# EasyEDA schematic bleeding_edge_full_control_pcb_layout.json
TITLE: BE Rancilio-PID - FULL CONTROL -  PCB Layout; REV: 0.7; Date: 2023-02-23; Sheet: 1/1; Company: bleeding edge rancilio-pid
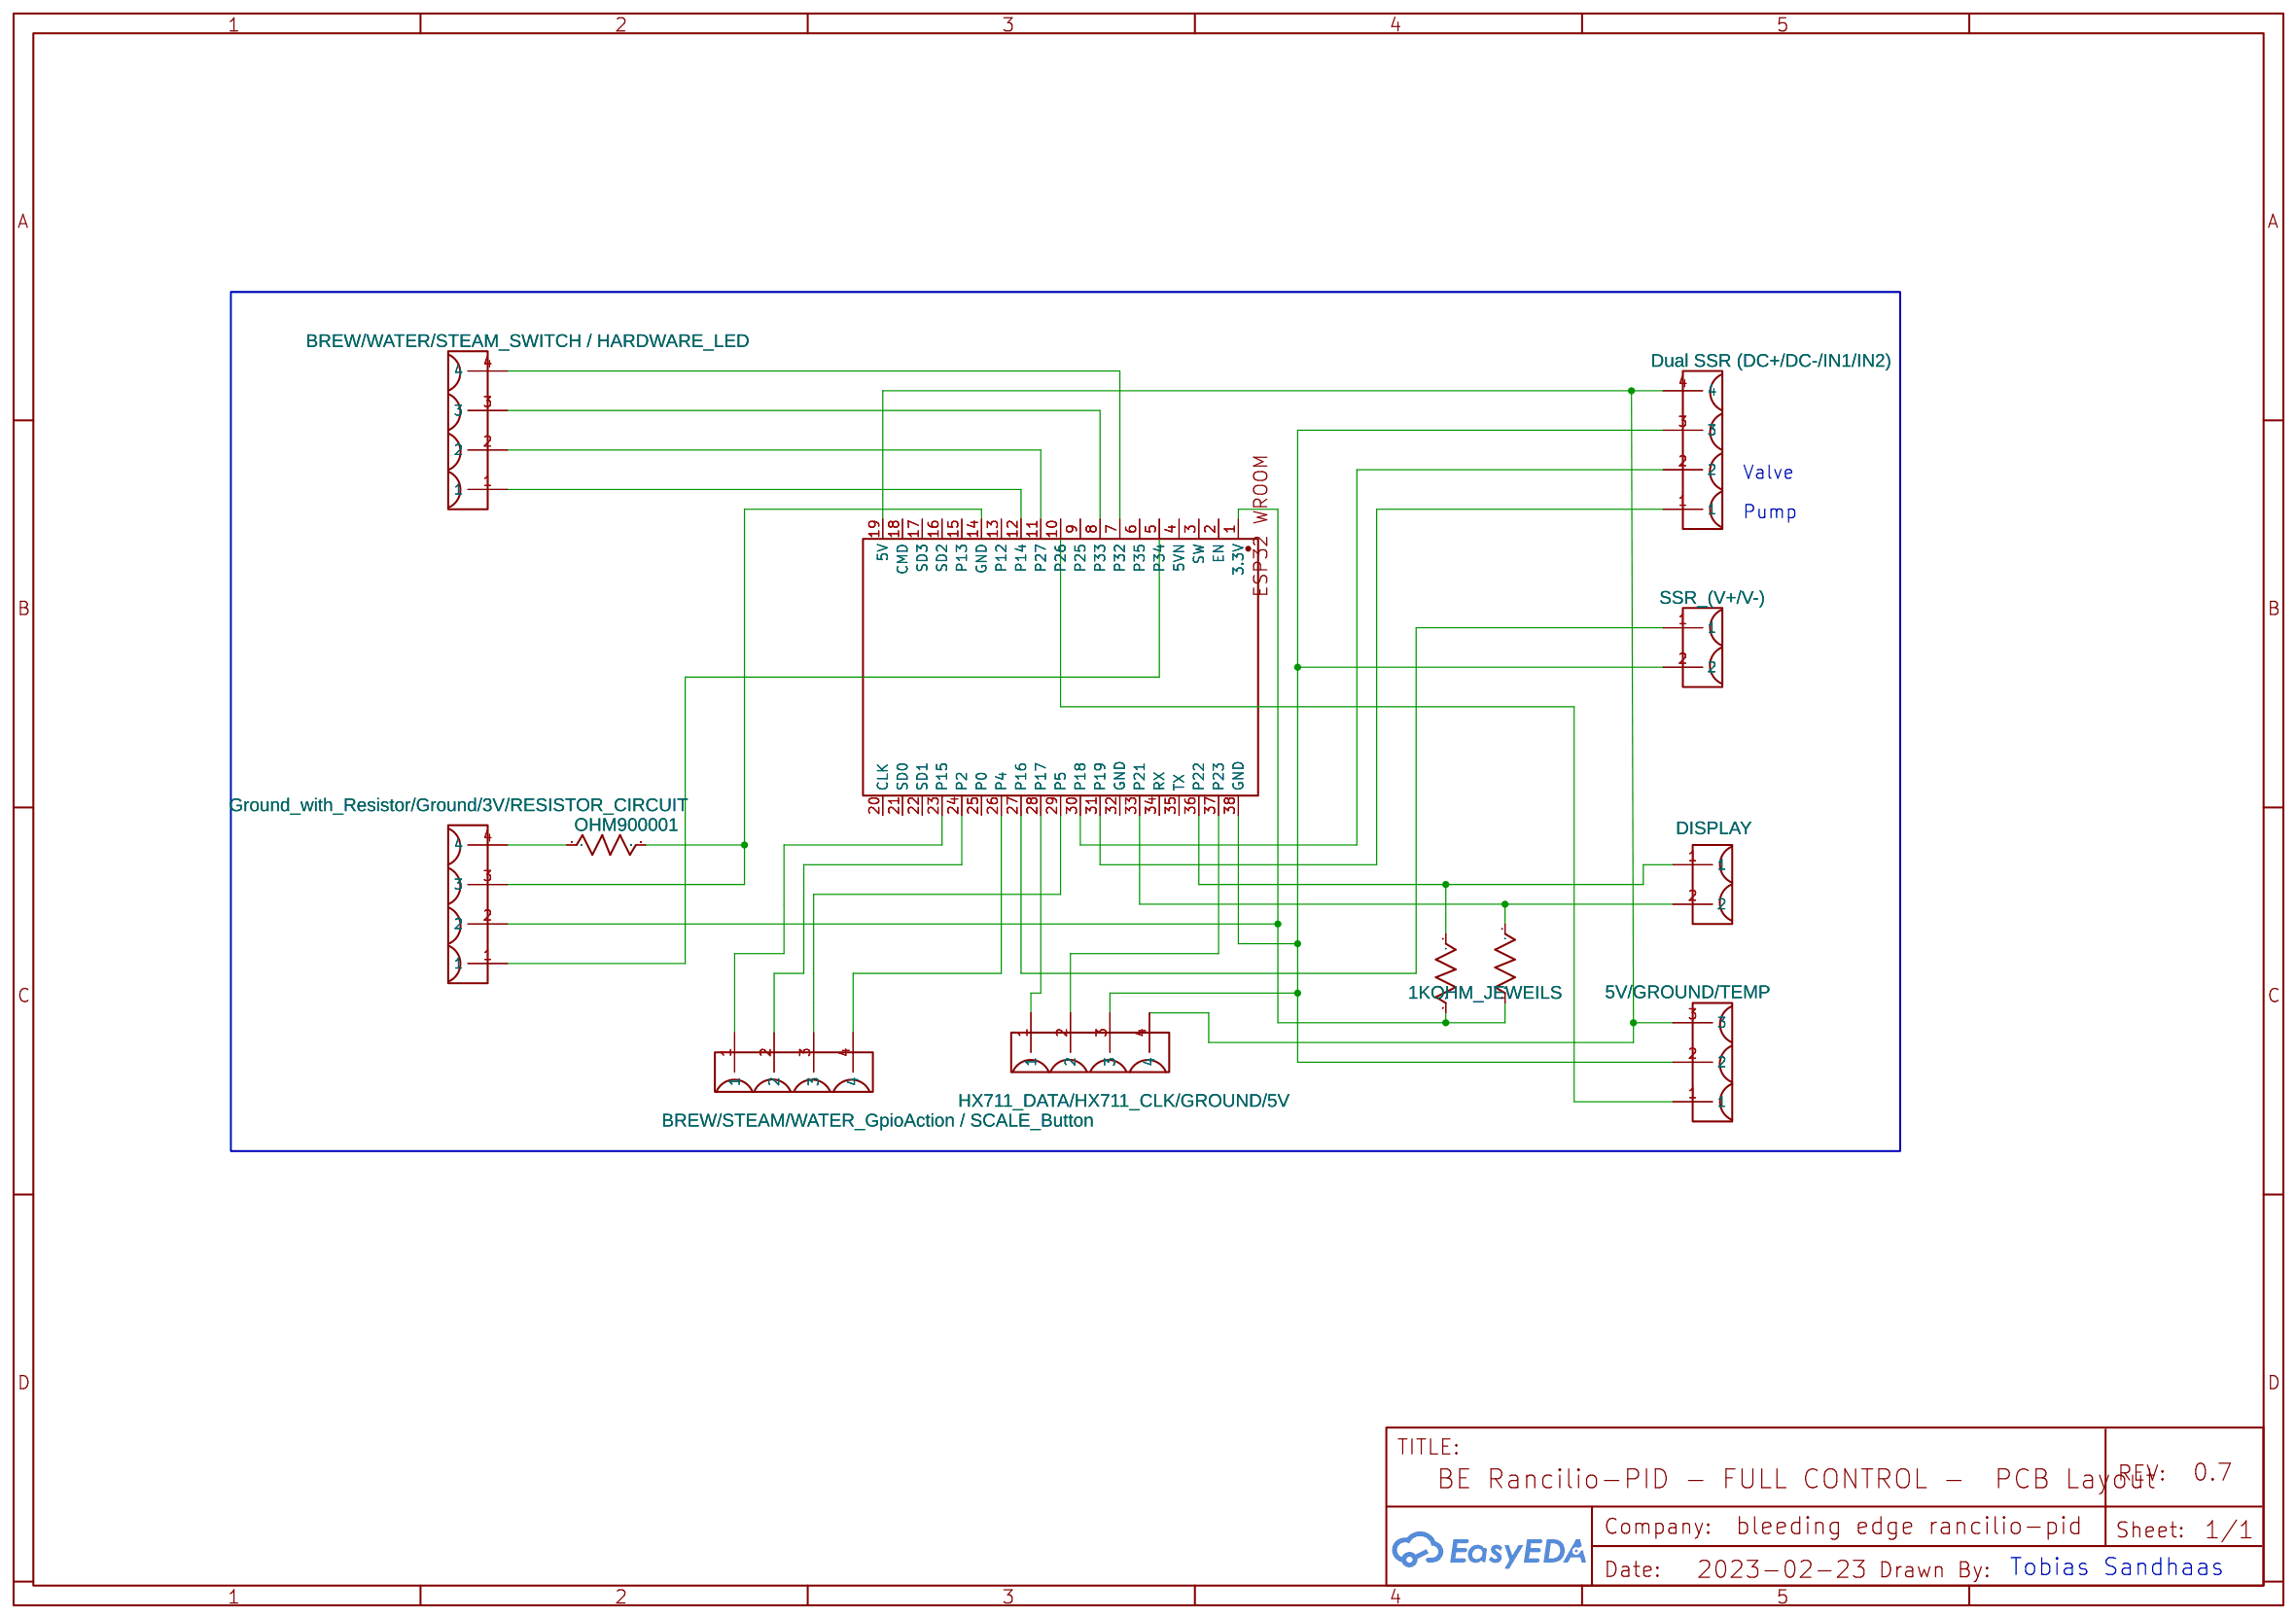
[diagram p0: schematic sheet]

## Parts
1KOHM_JEWEILS  1k  [R0603]
2KOHM  1k  [R0603]
5V/GROUND/TEMP  POWER_3V  [P2024A-PCB]
300OHM?#1  1k
DISPLAY  connector,_PCB_Mount,_5.08mm,_2_Way_blue_copy  [P2024A-PCB]
ESP32  ESP32
SSR_(V+/V-)  connector,_PCB_Mount,_5.08mm,_2_Way_blue_copy  [P2024A-PCB]
U1  Dual SSR (DC+/DC-/IN1/IN2)  [P2024A-PCB]
U2  HX711_DATA/HX711_CLK/GROUND/5V  [P2024A-PCB]
U4  BREW/WATER/STEAM_SWITCH / HARDWARE_LED  [P2024A-PCB]
U5  Ground_with_Resistor/Ground/3V/RESISTOR_CIRCUIT  [P2024A-PCB]
U6  BREW/STEAM/WATER_GpioAction / SCALE_Button  [P2024A-PCB]

## Library data of the parts
1KOHM_JEWEILS 2KOHM = R_0603_US: Contributor: LCEDA_Lib
5V/GROUND/TEMP = connector,_PCB_Mount,_5.08mm,_3_Way_blue_copy: Manufacturer Part: Terminal Block, PCB Mount, 5mm, 3 Way; Supplier Part: P2024A; link: http://www.altronics.com.au/p/p2024a-dinkle-3-way-5mm-mini-pcb-mount-terminal-block/; Contributor: Jörgen Jonsson
300OHM?#1 = R_0603_US
DISPLAY SSR_(V+/V-) = connector,_PCB_Mount,_5.08mm,_2_Way_blue_copy: Manufacturer Part: Terminal Block, PCB Mount, 5mm, 3 Way; Supplier Part: P2024A; link: http://www.altronics.com.au/p/p2024a-dinkle-3-way-5mm-mini-pcb-mount-terminal-block/; Contributor: Jörgen Jonsson
ESP32 = ESP32 WROOM BREAKOUT BOARD: Contributor: bnyacuma
U1 U2 U4-U6 = connector,_PCB_Mount,_5.08mm,_4_Way_blue copy: Manufacturer Part: Terminal Block, PCB Mount, 5mm, 4 Way; Supplier Part: P2024A; link: http://www.altronics.com.au/p/p2024a-dinkle-3-way-5mm-mini-pcb-mount-terminal-block/; Contributor: Jörgen Jonsson

## Nets
Net-(5V/GROUND/TEMP-Pad2): 5V/GROUND/TEMP.2 ESP32.38(GND) SSR_(V+/V-).2 U1.3 U2.3
Net-(300OHM?#1-Pad1): 300OHM?#1.1 U5.4
Net-(ESP32-3.3V): 1KOHM_JEWEILS.2 2KOHM.2 ESP32.1(3.3V) U5.2
Net-(ESP32-5V): 5V/GROUND/TEMP.3 ESP32.19(5V) U1.4 U2.4
Net-(ESP32-GND-Pad14): 300OHM?#1.2 ESP32.14(GND) U5.3
Net-(ESP32-P2): ESP32.24(P2) U6.2
Net-(ESP32-P4): ESP32.26(P4) U6.4
Net-(ESP32-P5): ESP32.29(P5) U6.3
Net-(ESP32-P14): ESP32.12(P14) U4.1
Net-(ESP32-P15): ESP32.23(P15) U6.1
Net-(ESP32-P16): ESP32.27(P16) SSR_(V+/V-).1
Net-(ESP32-P17): ESP32.28(P17) U2.1
Net-(ESP32-P18): ESP32.30(P18) U1.2
Net-(ESP32-P19): ESP32.31(P19) U1.1
Net-(ESP32-P21): 1KOHM_JEWEILS.1 DISPLAY.2 ESP32.33(P21)
Net-(ESP32-P22): 2KOHM.1 DISPLAY.1 ESP32.36(P22)
Net-(ESP32-P23): ESP32.37(P23) U2.2
Net-(ESP32-P26): 5V/GROUND/TEMP.1 ESP32.10(P26)
Net-(ESP32-P27): ESP32.11(P27) U4.2
Net-(ESP32-P32): ESP32.7(P32) U4.4
Net-(ESP32-P33): ESP32.8(P33) U4.3
Net-(ESP32-P34): ESP32.5(P34) U5.1

Not connected (* = marked no-connect by the designer): ESP32 2(EN) 3(SW) 4(5VN) 6(P35) 9(P25) 13(P12) 15(P13) 16(SD2) 17(SD3) 18(CMD) 20(CLK) 21(SD0) 22(SD1) 25(P0) 32(GND) 34(RX) 35(TX)

## Notes on the sheet
- Valve
- Pump
- Tobias Sandhaas
